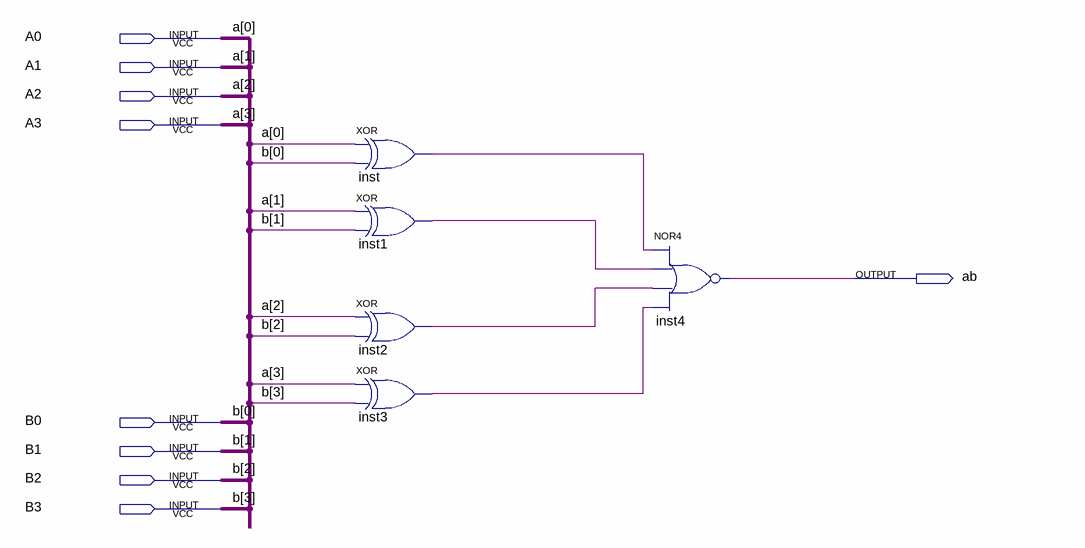
[diagram p0: schematic sheet]
// Quartus schematic comparador.bdf as structural Verilog: 5 symbols, 9 pins
module comparador (
  input  A0,
  input  A1,
  input  A2,
  input  A3,
  input  B0,
  input  B1,
  input  B2,
  input  B3,
  output ab
);

  wire inst1_out, inst2_out, inst3_out, inst_out;

  xor inst (inst_out, A0, B0);
  xor inst1 (inst1_out, A1, B1);
  xor inst2 (inst2_out, A2, B2);
  xor inst3 (inst3_out, A3, B3);
  nor inst4 (ab, inst_out, inst1_out, inst2_out, inst3_out);
endmodule
